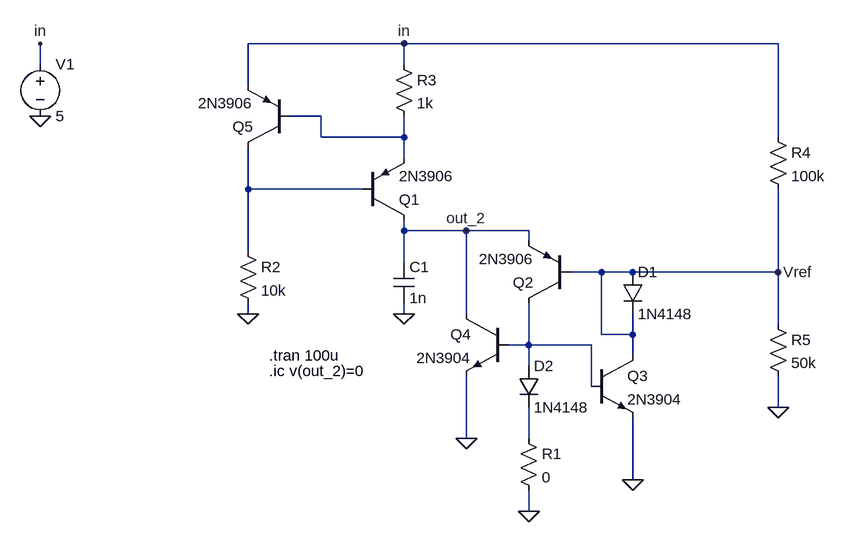
[diagram p0: schematic SAW-TOOTH_PROVA_3.asc]
SAW-TOOTH_PROVA_3.asc, the LTspice schematic file:
Version 4.1
SHEET 1 2048 1760
WIRE 240 -96 0 -96
WIRE 816 -96 240 -96
WIRE -320 -64 -320 -96
WIRE 240 -64 240 -96
WIRE 0 -32 0 -96
WIRE 112 16 64 16
WIRE 112 48 112 16
WIRE 240 48 240 16
WIRE 240 48 112 48
WIRE 816 48 816 -96
WIRE 240 80 240 48
WIRE 0 128 0 64
WIRE 176 128 0 128
WIRE 240 192 240 176
WIRE 336 192 240 192
WIRE 432 192 336 192
WIRE 432 208 432 192
WIRE 0 224 0 128
WIRE 240 240 240 192
WIRE 544 256 496 256
WIRE 592 256 544 256
WIRE 816 256 816 128
WIRE 816 256 592 256
WIRE 0 320 0 304
WIRE 240 320 240 304
WIRE 336 320 336 192
WIRE 816 336 816 256
WIRE 544 352 544 256
WIRE 592 352 592 320
WIRE 592 352 544 352
WIRE 432 368 432 304
WIRE 432 368 400 368
WIRE 528 368 432 368
WIRE 592 384 592 352
WIRE 432 400 432 368
WIRE 528 432 528 368
WIRE 816 464 816 416
WIRE 336 512 336 416
WIRE 432 512 432 464
WIRE 592 576 592 480
WIRE 432 624 432 592
FLAG -320 16 0
FLAG 0 320 0
FLAG 240 320 0
FLAG 816 464 0
FLAG 592 576 0
FLAG 336 192 out_2
FLAG 336 512 0
FLAG -320 -96 in
FLAG 240 -96 in
FLAG 432 624 0
FLAG 816 256 Vref
SYMBOL voltage -320 -80 R0
WINDOW 123 0 0 Left 0
WINDOW 39 0 0 Left 0
SYMATTR InstName V1
SYMATTR Value 5
SYMBOL res -16 208 R0
SYMATTR InstName R2
SYMATTR Value 10k
SYMBOL res 224 -80 R0
SYMATTR InstName R3
SYMATTR Value 1k
SYMBOL cap 224 240 R0
SYMATTR InstName C1
SYMATTR Value 1n
SYMBOL pnp 176 176 M180
SYMATTR InstName Q1
SYMATTR Value 2N3906
SYMBOL res 800 32 R0
SYMATTR InstName R4
SYMATTR Value 100k
SYMBOL res 800 320 R0
SYMATTR InstName R5
SYMATTR Value 50k
SYMBOL pnp 496 304 R180
SYMATTR InstName Q2
SYMATTR Value 2N3906
SYMBOL npn 528 384 R0
SYMATTR InstName Q3
SYMATTR Value 2N3904
SYMBOL npn 400 320 M0
SYMATTR InstName Q4
SYMATTR Value 2N3904
SYMBOL diode 416 400 R0
SYMATTR InstName D2
SYMATTR Value 1N4148
SYMBOL pnp 64 64 R180
SYMATTR InstName Q5
SYMATTR Value 2N3906
SYMBOL diode 576 256 R0
SYMATTR InstName D1
SYMATTR Value 1N4148
SYMBOL res 416 496 R0
SYMATTR InstName R1
SYMATTR Value 0
TEXT 32 384 Left 2 !.tran 100u
TEXT 32 408 Left 2 !.ic v(out_2)=0

The netlist it stands for:
* SAW-TOOTH_PROVA_3.asc
V1 in 0 5
R2 N002 0 10k
R3 in N001 1k
C1 out_2 0 1n
Q1 out_2 N002 N001 0 2N3906
R4 in Vref 100k
R5 Vref 0 50k
Q2 N003 Vref out_2 0 2N3906
Q3 Vref N003 0 0 2N3904
Q4 out_2 N003 0 0 2N3904
D2 N003 N004 1N4148
Q5 N002 N001 in 0 2N3906
D1 Vref Vref 1N4148
R1 N004 0 0
.model D D
.lib standard.dio
.model NPN NPN
.model PNP PNP
.lib standard.bjt
.tran 100u
.ic v(out_2)=0
.backanno
.end